# Altium schematic sheet USART.SchDoc
size A4
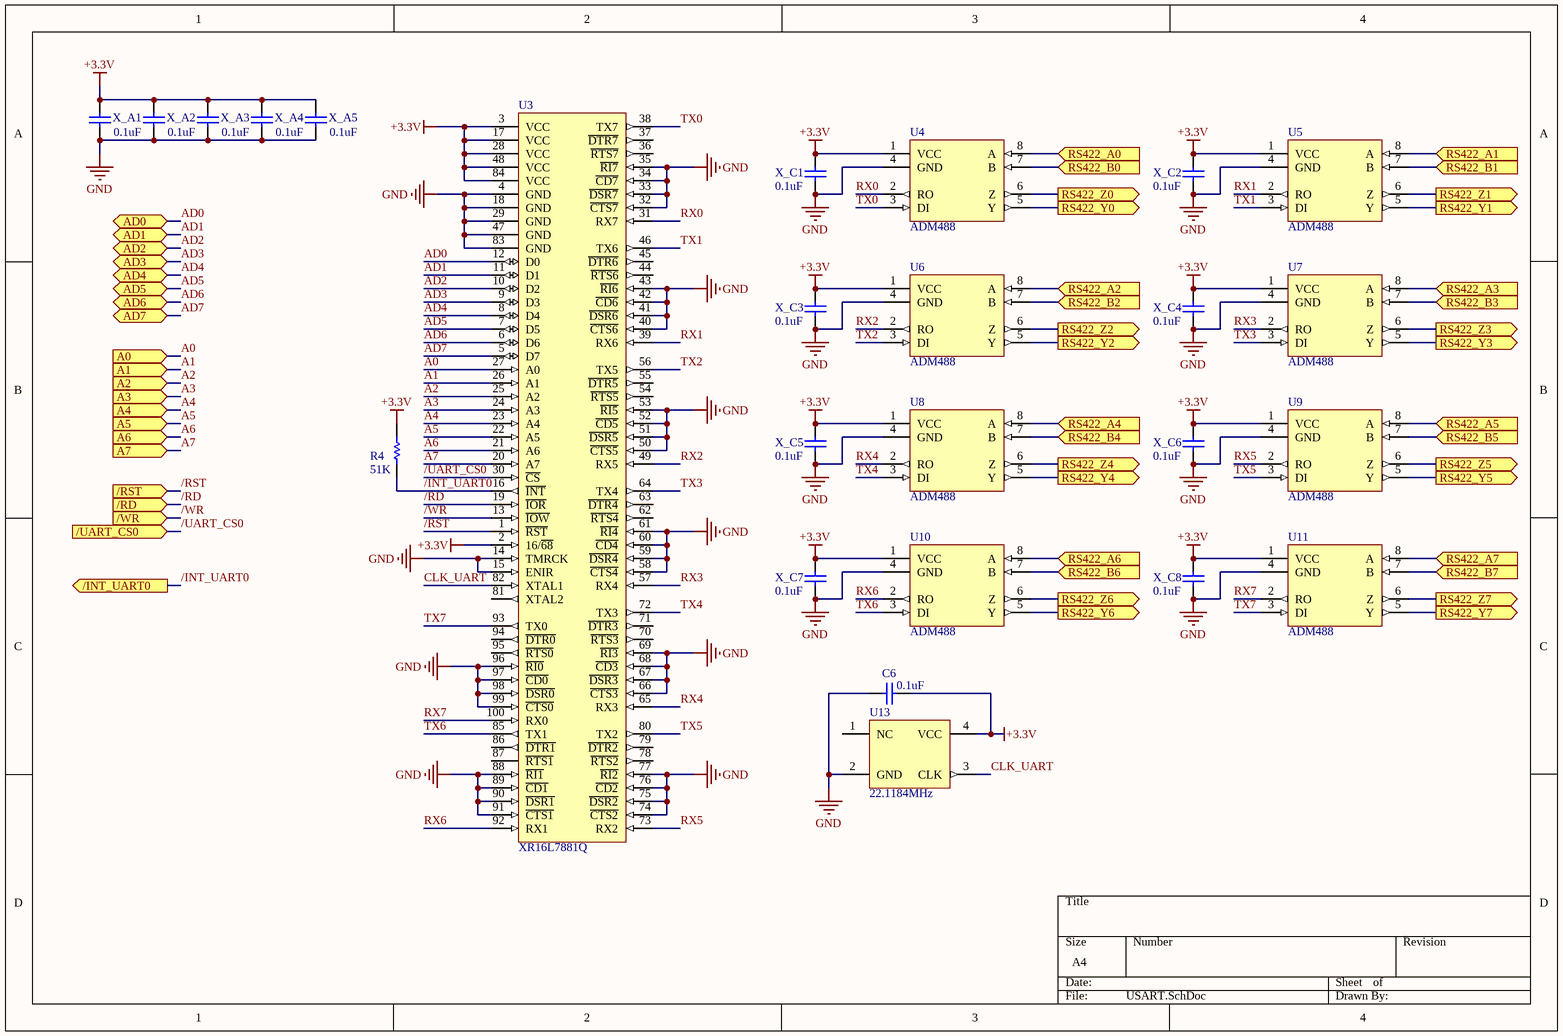
[diagram p0: USART.SchDoc]

## Parts
C6  value 0.1uF  [0805]  (hidden comment: Cap 0.1uf)
R4  51k  [0805]
U3  XR16L7881Q  [QFP65P1800X2400X300-100N_30*20]
U4  ADM488  [SO-8_L]
U5  ADM488  [SO-8_L]
U6  ADM488  [SO-8_L]
U7  ADM488  [SO-8_L]
U8  ADM488  [SO-8_L]
U9  ADM488  [SO-8_L]
U10  ADM488  [SO-8_L]
U11  ADM488  [SO-8_L]
U13  22.1184MHz  [my_SiT8103]
X_A1  value 0.1uF  [0805]  (hidden comment: Cap 0.1uf)
X_A2  value 0.1uF  [0805]  (hidden comment: Cap 0.1uf)
X_A3  value 0.1uF  [0805]  (hidden comment: Cap 0.1uf)
X_A4  value 0.1uF  [0805]  (hidden comment: Cap 0.1uf)
X_A5  value 0.1uF  [0805]  (hidden comment: Cap 0.1uf)
X_C1  value 0.1uF  [0805]  (hidden comment: Cap 0.1uf)
X_C2  value 0.1uF  [0805]  (hidden comment: Cap 0.1uf)
X_C3  value 0.1uF  [0805]  (hidden comment: Cap 0.1uf)
X_C4  value 0.1uF  [0805]  (hidden comment: Cap 0.1uf)
X_C5  value 0.1uF  [0805]  (hidden comment: Cap 0.1uf)
X_C6  value 0.1uF  [0805]  (hidden comment: Cap 0.1uf)
X_C7  value 0.1uF  [0805]  (hidden comment: Cap 0.1uf)
X_C8  value 0.1uF  [0805]  (hidden comment: Cap 0.1uf)

## Ports
/INT_UART0 (out), /RD (in), /RST (in), /UART_CS0 (in), /WR (in), A0 (in), A1 (in), A2 (in), A3 (in), A4 (in), A5 (in), A6 (in), A7 (in), AD0 (bidir), AD1 (bidir), AD2 (bidir), AD3 (bidir), AD4 (bidir), AD5 (bidir), AD6 (bidir), AD7 (bidir), RS422_A0 (in), RS422_A1 (in), RS422_A2 (in), RS422_A3 (in), RS422_A4 (in), RS422_A5 (in), RS422_A6 (in), RS422_A7 (in), RS422_B0 (in), RS422_B1 (in), RS422_B2 (in), RS422_B3 (in), RS422_B4 (in), RS422_B5 (in), RS422_B6 (in), RS422_B7 (in), RS422_Y0 (out), RS422_Y1 (out), RS422_Y2 (out), RS422_Y3 (out), RS422_Y4 (out), RS422_Y5 (out), RS422_Y6 (out), RS422_Y7 (out), RS422_Z0 (out), RS422_Z1 (out), RS422_Z2 (out), RS422_Z3 (out), RS422_Z4 (out), RS422_Z5 (out), RS422_Z6 (out), RS422_Z7 (out)

## Nets
+3.3V: C6.1 R4.2 U3.2(16/~{68}) U3.3(VCC) U3.17(VCC) U3.28(VCC) U3.48(VCC) U3.84(VCC) U4.1(VCC) U5.1(VCC) U6.1(VCC) U7.1(VCC) U8.1(VCC) U9.1(VCC) U10.1(VCC) U11.1(VCC) U13.4(VCC) X_A1.2 X_A2.2 X_A3.2 X_A4.2 X_A5.2 X_C1.2 X_C2.2 X_C3.2 X_C4.2 X_C5.2 X_C6.2 X_C7.2 X_C8.2
GND: C6.2 U3.4(GND) U3.14(TMRCK) U3.15(ENIR) U3.18(GND) U3.29(GND) U3.32(~{CTS7}) U3.33(~{DSR7}) U3.34(~{CD7}) U3.35(~{RI7}) U3.40(~{CTS6}) U3.41(~{DSR6}) U3.42(~{CD6}) U3.43(~{RI6}) U3.47(GND) U3.50(~{CTS5}) U3.51(~{DSR5}) U3.52(~{CD5}) U3.53(~{RI5}) U3.58(~{CTS4}) U3.59(~{DSR4}) U3.60(~{CD4}) U3.61(~{RI4}) U3.66(~{CTS3}) U3.67(~{DSR3}) U3.68(~{CD3}) U3.69(~{RI3}) U3.74(~{CTS2}) U3.75(~{DSR2}) U3.76(~{CD2}) U3.77(~{RI2}) U3.83(GND) U3.88(~{RI1}) U3.89(~{CD1}) U3.90(~{DSR1}) U3.91(~{CTS1}) U3.96(~{RI0}) U3.97(~{CD0}) U3.98(~{DSR0}) U3.99(~{CTS0}) U4.4(GND) U5.4(GND) U6.4(GND) U7.4(GND) U8.4(GND) U9.4(GND) U10.4(GND) U11.4(GND) U13.2(GND) X_A1.1 X_A2.1 X_A3.1 X_A4.1 X_A5.1 X_C1.1 X_C2.1 X_C3.1 X_C4.1 X_C5.1 X_C6.1 X_C7.1 X_C8.1
/INT_UART0: R4.1 U3.16(~{INT}) ; port /INT_UART0
/RD: U3.19(~{IOR}) ; port /RD
/RST: U3.1(~{RST}) ; port /RST
/UART_CS0: U3.30(~{CS}) ; port /UART_CS0
/WR: U3.13(~{IOW}) ; port /WR
A0: U3.27(A0) ; port A0
A1: U3.26(A1) ; port A1
A2: U3.25(A2) ; port A2
A3: U3.24(A3) ; port A3
A4: U3.23(A4) ; port A4
A5: U3.22(A5) ; port A5
A6: U3.21(A6) ; port A6
A7: U3.20(A7) ; port A7
AD0: U3.12(D0) ; port AD0
AD1: U3.11(D1) ; port AD1
AD2: U3.10(D2) ; port AD2
AD3: U3.9(D3) ; port AD3
AD4: U3.8(D4) ; port AD4
AD5: U3.7(D5) ; port AD5
AD6: U3.6(D6) ; port AD6
AD7: U3.5(D7) ; port AD7
CLK_UART: U3.82(XTAL1) U13.3(CLK)
RS422_A0: U4.8(A) ; port RS422_A0
RS422_A1: U5.8(A) ; port RS422_A1
RS422_A2: U6.8(A) ; port RS422_A2
RS422_A3: U7.8(A) ; port RS422_A3
RS422_A4: U8.8(A) ; port RS422_A4
RS422_A5: U9.8(A) ; port RS422_A5
RS422_A6: U10.8(A) ; port RS422_A6
RS422_A7: U11.8(A) ; port RS422_A7
RS422_B0: U4.7(B) ; port RS422_B0
RS422_B1: U5.7(B) ; port RS422_B1
RS422_B2: U6.7(B) ; port RS422_B2
RS422_B3: U7.7(B) ; port RS422_B3
RS422_B4: U8.7(B) ; port RS422_B4
RS422_B5: U9.7(B) ; port RS422_B5
RS422_B6: U10.7(B) ; port RS422_B6
RS422_B7: U11.7(B) ; port RS422_B7
RS422_Y0: U4.5(Y) ; port RS422_Y0
RS422_Y1: U5.5(Y) ; port RS422_Y1
RS422_Y2: U6.5(Y) ; port RS422_Y2
RS422_Y3: U7.5(Y) ; port RS422_Y3
RS422_Y4: U8.5(Y) ; port RS422_Y4
RS422_Y5: U9.5(Y) ; port RS422_Y5
RS422_Y6: U10.5(Y) ; port RS422_Y6
RS422_Y7: U11.5(Y) ; port RS422_Y7
RS422_Z0: U4.6(Z) ; port RS422_Z0
RS422_Z1: U5.6(Z) ; port RS422_Z1
RS422_Z2: U6.6(Z) ; port RS422_Z2
RS422_Z3: U7.6(Z) ; port RS422_Z3
RS422_Z4: U8.6(Z) ; port RS422_Z4
RS422_Z5: U9.6(Z) ; port RS422_Z5
RS422_Z6: U10.6(Z) ; port RS422_Z6
RS422_Z7: U11.6(Z) ; port RS422_Z7
RX0: U3.31(RX7) U4.2(RO)
RX1: U3.39(RX6) U5.2(RO)
RX2: U3.49(RX5) U6.2(RO)
RX3: U3.57(RX4) U7.2(RO)
RX4: U3.65(RX3) U8.2(RO)
RX5: U3.73(RX2) U9.2(RO)
RX6: U3.92(RX1) U10.2(RO)
RX7: U3.100(RX0) U11.2(RO)
TX0: U3.38(TX7) U4.3(DI)
TX1: U3.46(TX6) U5.3(DI)
TX2: U3.56(TX5) U6.3(DI)
TX3: U3.64(TX4) U7.3(DI)
TX4: U3.72(TX3) U8.3(DI)
TX5: U3.80(TX2) U9.3(DI)
TX6: U3.85(TX1) U10.3(DI)
TX7: U3.93(TX0) U11.3(DI)

Not connected (* = marked no-connect by the designer): U3 36(~{RTS7}) 37(~{DTR7}) 44(~{RTS6}) 45(~{DTR6}) 54(~{RTS5}) 55(~{DTR5}) 62(~{RTS4}) 63(~{DTR4}) 70(~{RTS3}) 71(~{DTR3}) 78(~{RTS2}) 79(~{DTR2}) 81(XTAL2) 86(~{DTR1}) 87(~{RTS1}) 94(~{DTR0}) 95(~{RTS0}); U13 1(NC)

## Library data of the parts
C6 X_A1-X_A5 X_C1-X_C8 = Cap: Capacitor; Published: 8-Jun-2000; LatestRevisionDate: 17-Jul-2002; LatestRevisionNote: Re-released for DXP Platform.; PackageReference: RAD-0.3; Publisher: Altium Limited; PackageDescription: Radial Cap, Thru-Hole; 2 Leads; 0.3 in Pin Spacing
R4 = Res1: Resistor; Published: 8-Jun-2000; LatestRevisionDate: 17-Jul-2002; LatestRevisionNote: Re-released for DXP Platform.; PackageReference: AXIAL-0.3; Publisher: Altium Limited; PackageDescription: Axial Device, Thru-Hole; 2 Leads; 0.3 in Pin Spacing; Value: 51K
U3 = my_XR16L7881Q
U4-U11 = my_ADM488
U13 = my_SiT8103